# Altium project lamp_controller.PrjPcb (part 2 of 4)
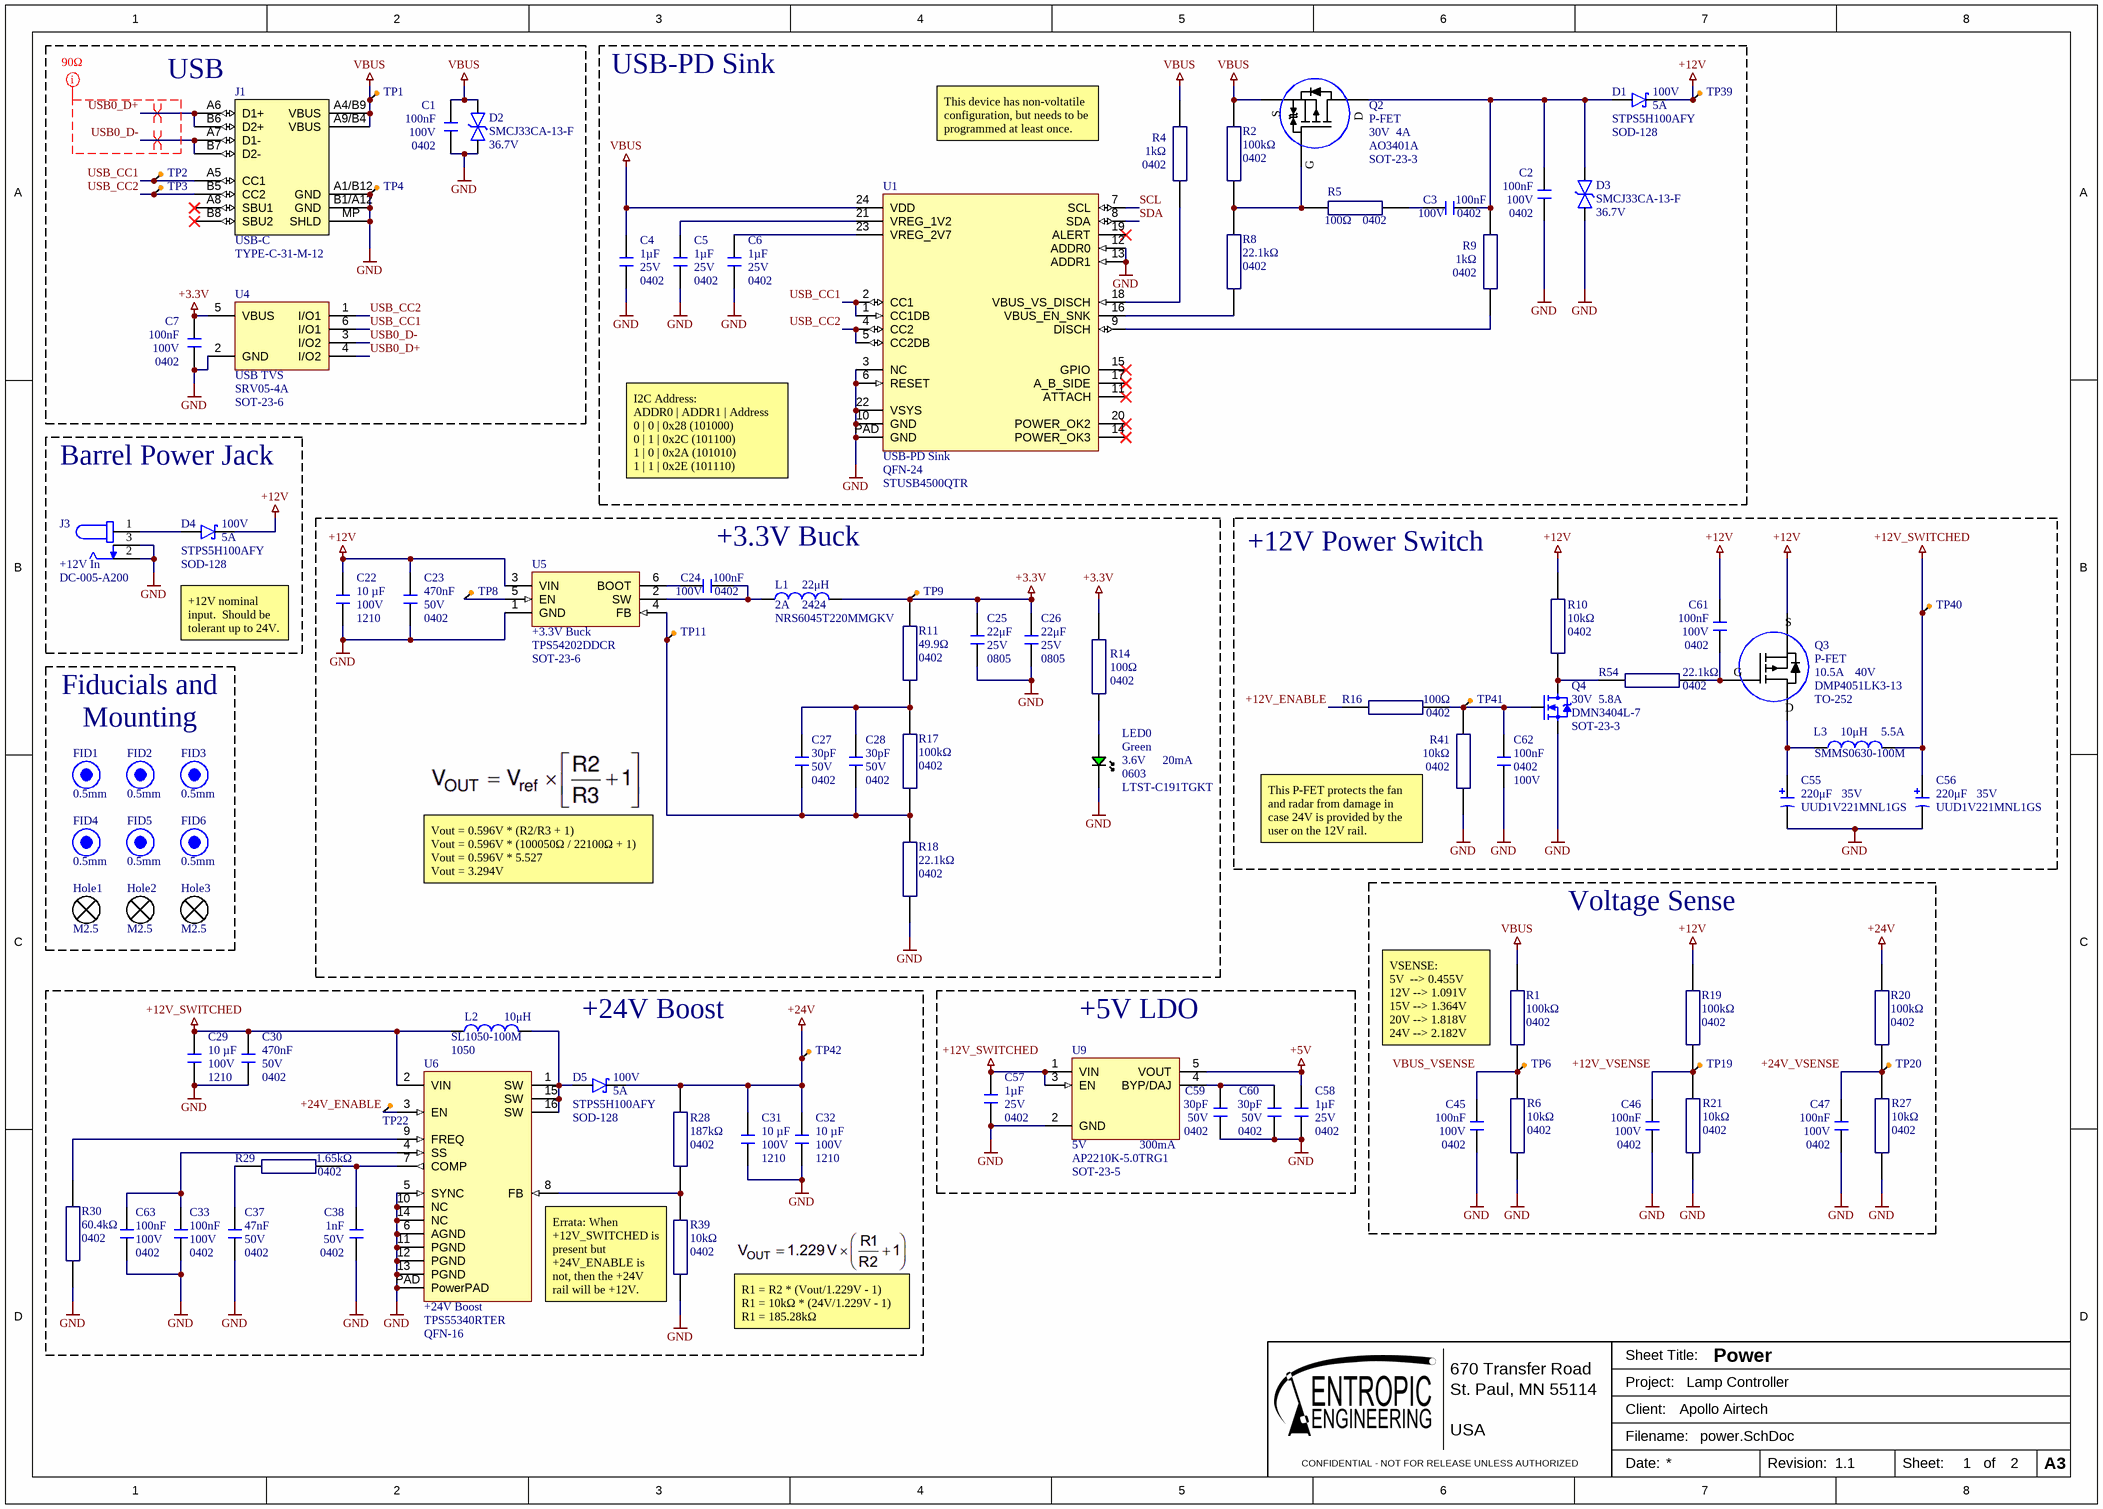
[diagram p3: power.SchDoc]

## Sheet power.SchDoc: Power (continued)
### Library data of the parts
C1-C3 C7 C24 C33 C45-C47 C61-C63 = GRM155R62A104KE14D: 100 nF, 100 V, X7R, 0402 Chip capacitor; Manufacturer: Murata; Dielectric Material: Ceramic; Multilayer: Yes; Tolerance  (fill in as +-): 10%; Temperature Characteristics Code: X5R; Supplier 1: LCSC; Supplier Part Number 1: C162178; RoHS: Yes; Category: Ceramic Capacitors; Pricing 1: 50=0.0085, 500=0.0066, 1500=0.0057, 10000=0.0051, 20000=0.0048, 50000=0.0047 (USD); Min Operating Temperature: -55°C; Max Operating Temperature: 85°C; Packaging: Tape and Reel; Termination: Wraparound; RoHS Compliant: Yes; ComponentLink1URL: https://datasheet.ciiva.com:443/pdfs/VipMasterIC/IC/MURE/MURE-S-A0004362469/MURE-S-A0004364737-1.pdf?src-supplier=IHS+Markit; ComponentLink1Description: https://datasheet.ciiva.com:443/pdfs/VipMasterIC/IC/MURE/MURE-S-A0004362469/MURE-S-A0004364737-1.pdf?src-supplier=IHS+Markit; ComponentLink2URL: http://www.farnell.com/datasheets/2079151.pdf?src-supplier=Farnell; ComponentLink2Description: http://www.farnell.com/datasheets/2079151.pdf?src-supplier=Farnell; ComponentLink3URL: http://www.mouser.com/ds/2/281/c02e-2905.pdf?src-supplier=Mouser; ComponentLink3Description: http://www.mouser.com/ds/2/281/c02e-2905.pdf?src-supplier=Mouser; ComponentLink4URL: http://www.farnell.com/datasheets/2079151.pdf?src-supplier=Element14; ComponentLink4Description: http://www.farnell.com/datasheets/2079151.pdf?src-supplier=Element14; ComponentLink5URL: http://www.farnell.com/datasheets/2079151.pdf?src-supplier=Newark; ComponentLink5Description: http://www.farnell.com/datasheets/2079151.pdf?src-supplier=Newark; ComponentLink6URL: https://datasheet.octopart.com/GRM155R62A104KE14D-Murata-datasheet-149523038.pdf?src-supplier=Newark; ComponentLink6Description: https://datasheet.octopart.com/GRM155R62A104KE14D-Murata-datasheet-149523038.pdf?src-supplier=Newark; ComponentLink7URL: https://datasheet.octopart.com/GRM155R62A104KE14D-Murata-datasheet-66077071.pdf?src-supplier=Element14; ComponentLink7Description: https://datasheet.octopart.com/GRM155R62A104KE14D-Murata-datasheet-66077071.pdf?src-supplier=Element14; ComponentLink8URL: http://search.murata.co.jp/Ceramy/image/img/A01X/G101/ENG/GRM155R62A104KE14-01.pdf?src-supplier=Digikey; ComponentLink8Description: http://search.murata.co.jp/Ceramy/image/img/A01X/G101/ENG/GRM155R62A104KE14-01.pdf?src-supplier=Digikey; ComponentLink9URL: https://datasheet.octopart.com/GRM155R62A104KE14D-Murata-datasheet-22122223.pdf?src-supplier=Future+Electronics; ComponentLink9Description: https://datasheet.octopart.com/GRM155R62A104KE14D-Murata-datasheet-22122223.pdf?src-supplier=Future+Electronics; Manufacturer Part Number: GRM155R62A104KE14D; Stock 1: 283300; Mounting Technology: Surface Mount; Pins: 2; Package Shape: Rectangular; Terminal Finish: Nickel; JESD-609 Code: e3; Capacitor Type: Ceramic; Tolerance (fill in as +-): 10%; Reach SVHC Compliant: Yes; ComponentLink10URL: https://datasheet.octopart.com/GRM155R62A104KE14D-Murata-datasheet-165579666.pdf?src-supplier=TME; ComponentLink10Description: https://datasheet.octopart.com/GRM155R62A104KE14D-Murata-datasheet-165579666.pdf?src-supplier=TME
C4-C6 C57 C58 = GRM155R61E105KA12D: 1 µF, 25 V, X5R, 0402 Chip capacitor; Manufacturer: Murata; house_part_number: C-1uF-0402-002; Dielectric Material: Ceramic; Multilayer: Yes; Negative Tolerance: 10%; Supplier 1: Digi-Key; Supplier Part Number 1: 490-10017-1-ND; RoHS: Yes; Category: Ceramic Capacitors; Stock 1: 145965; Pricing 1: 1=0.11000, 10=0.08300, 50=0.04560, 100=0.03720, 500=0.02656, 1000=0.02087, 2500=0.01898, 5000=0.01746 (USD); Mount: Surface Mount; Number of Pins: 2; Package Shape: Rectangular; Terminal Finish: Nickel; Min Operating Temperature: -55°C; Max Operating Temperature: 85°C; JESD-609 Code: e3; Capacitor Type: Ceramic; Package Style: SMTMeter; Packaging: Tape and Reel; Positive Tolerance: 10%; Temperature Characteristics Code: X5R; Termination: Wraparound; Length: 1mm; Width: 0.5mm; Height: 0.5mm; REACH SVHC: Yes; RoHS Compliant: Yes; ComponentLink1URL: https://datasheet.ciiva.com:443/pdfs/VipMasterIC/IC/MURE/MURE-S-A0004362469/MURE-S-A0004364524-1.pdf?src-supplier=IHS+Markit; ComponentLink1Description: https://datasheet.ciiva.com:443/pdfs/VipMasterIC/IC/MURE/MURE-S-A0004362469/MURE-S-A0004364524-1.pdf?src-supplier=IHS+Markit; ComponentLink2URL: https://datasheet.ciiva.com/7719/1666664-7719006.pdf?src-supplier=Element14; ComponentLink2Description: https://datasheet.ciiva.com/7719/1666664-7719006.pdf?src-supplier=Element14; ComponentLink3URL: https://datasheet.ciiva.com/22732/1666664-22732122.pdf?src-supplier=Element14; ComponentLink3Description: https://datasheet.ciiva.com/22732/1666664-22732122.pdf?src-supplier=Element14; Manufacturer Part Number: GRM155R61E105KA12D
C22 C29 C31 C32 = GRM32EC72A106KE05L: 10 µF, 100 V, 1210 Ceramic capacitor; Manufacturer: Murata; Tolerance: 10%; Supplier 1: Digi-Key; Stock 1: 4827; Pricing 1: 1=1.38, 10=1.087, 100=0.8151, 500=0.61582 (USD); Mount: Surface Mount; Case Code (Imperial): 1210; Case Code (Metric): 3225; Min Operating Temperature: -55°C; Max Operating Temperature: 125°C; Packaging: Tape and Reel; ComponentLink1URL: http://search.murata.co.jp/Ceramy/image/img/A01X/G101/ENG/GRM32EC72A106KE05-01.pdf?src-supplier=Digi-Key; ComponentLink1Description: http://search.murata.co.jp/Ceramy/image/img/A01X/G101/ENG/GRM32EC72A106KE05-01.pdf?src-supplier=Digi-Key; Supplier Part Number 1: 490-16266-1-ND; Manufacturer Part Number: GRM32EC72A106KE05L
C23 C30 = GRM155R61H474KE11D: 470 nF, 50 V, X5R, 0402 Chip capacitor; Manufacturer: Murata; house_part_number: C-470nF-0402-002; Tolerance: 10%; Supplier 1: Digi-Key; Supplier Part Number 1: 490-16354-1-ND; RoHS: Yes; Category: Ceramic Capacitors; Pricing 1: 1=0.20000, 10=0.14600, 50=0.08260, 100=0.06840, 500=0.04798, 1000=0.03972, 2500=0.03696, 5000=0.03382 (USD); Dielectric: X5R; Length: 1mm; Width: 500um; Thickness: 500um; RoHS Compliant: Yes; ComponentLink1URL: http://search.murata.co.jp/Ceramy/image/img/A01X/G101/ENG/GRM155R61H474KE11-01.pdf?src-supplier=Digi-Key; ComponentLink1Description: http://search.murata.co.jp/Ceramy/image/img/A01X/G101/ENG/GRM155R61H474KE11-01.pdf?src-supplier=Digi-Key; ComponentLink2URL: https://search.murata.co.jp/Ceramy/image/img/A01X/G101/ENG/GRM155R61H474KE11-01.pdf?src-supplier=Digi-Key; ComponentLink2Description: https://search.murata.co.jp/Ceramy/image/img/A01X/G101/ENG/GRM155R61H474KE11-01.pdf?src-supplier=Digi-Key; Manufacturer Part Number: GRM155R61H474KE11D
C25 C26 = GRT21BR61E226ME13L: 22 μF, 25 V, X5R, 0805 Chip capacitor; Manufacturer: Murata; Dielectric Material: Ceramic; Multilayer: Yes; Tolerance  (fill in as +-): 20%; Reference Standard: AEC-Q200; Supplier 1: Digi-Key; RoHS: Yes; Category: Ceramic Capacitors; Stock 1: 1983731; Pricing 1: 1=0.48, 10=0.338, 50=0.2558, 100=0.2228, 500=0.16508, 1000=0.14031 (USD); Mounting Technology: Surface Mount; Pins: 2; Package Shape: Rectangular; Terminal Finish: Nickel; Min Operating Temperature: -55°C; Max Operating Temperature: 85°C; JESD-609 Code: e3; Capacitor Type: Ceramic; Packaging: Tape and Reel; Tolerance (fill in as +-): 20%; Temperature Characteristics Code: X5R; Termination: Wraparound; Reach SVHC Compliant: Yes; RoHS Compliant: Yes; ComponentLink1URL: https://datasheet.ciiva.com:443/pdfs/VipMasterIC/IC/MURE/MURE-S-A0004410517/MURE-S-A0004413512-1.pdf?src-supplier=IHS+Markit; ComponentLink1Description: https://datasheet.ciiva.com:443/pdfs/VipMasterIC/IC/MURE/MURE-S-A0004410517/MURE-S-A0004413512-1.pdf?src-supplier=IHS+Markit; ComponentLink2URL: http://search.murata.co.jp/Ceramy/image/img/A01X/G101/ENG/GRT21BR61E226ME13-01.pdf?src-supplier=Digi-Key; ComponentLink2Description: http://search.murata.co.jp/Ceramy/image/img/A01X/G101/ENG/GRT21BR61E226ME13-01.pdf?src-supplier=Digi-Key; Manufacturer Part Number: GRT21BR61E226ME13L; Supplier Part Number 1: 490-12389-1-ND
C27 C28 C59 C60 = GCM1555C1H300FA16D: 30 pF, 50 V, C0G, 0402 Chip capacitor; Manufacturer: Murata; Dielectric Material: Ceramic; Multilayer: Yes; Tolerance  (fill in as +-): 1%; Reference Standard: AEC-Q200; Supplier 1: LCSC; Manufacturer Part Number: GCM1555C1H300FA16D; RoHS: Yes; Category: Ceramic Capacitors; Stock 1: 20680; Pricing 1: 20=0.0242, 200=0.0198, 600=0.0174, 2000=0.0159, 10000=0.0143, 20000=0.0137 (USD); Mounting Technology: Surface Mount; Pins: 2; Package Shape: Rectangular; Min Operating Temperature: -55°C; Max Operating Temperature: 125°C; Capacitor Type: Ceramic; Packaging: Tape and Reel; Tolerance (fill in as +-): 1%; Temperature Characteristics Code: C0G; Termination: Wraparound; Reach SVHC Compliant: Yes; RoHS Compliant: Yes; ComponentLink1URL: https://psearch.en.murata.com:443/capacitor/product/GCM1555C1H300FA16%23.pdf?src-supplier=IHS+Markit; ComponentLink1Description: https://psearch.en.murata.com:443/capacitor/product/GCM1555C1H300FA16%23.pdf?src-supplier=IHS+Markit; Supplier Part Number 1: C2987943
C37 = GRM155R71H473KE14D: 47 nF, 50 V, X7R, 0402 Chip capacitor; Manufacturer: Murata; house_part_number: C-47nF-0402-001; Supplier 1: Digi-Key; Supplier Part Number 1: 490-10702-1-ND; RoHS: Yes; Category: Ceramic Capacitors; Stock 1: 874627; Pricing 1: 1=0.10000, 10=0.03000, 50=0.01660, 100=0.01350, 500=0.00966, 1000=0.00759, 2500=0.00690, 5000=0.00635 (USD); ComponentLink1URL: https://datasheet.ciiva.com:443/pdfs/VipMasterIC/IC/MURE/MURE-S-A0004362469/MURE-S-A0004364796-1.pdf?src-supplier=IHS+Markit; ComponentLink1Description: https://datasheet.ciiva.com:443/pdfs/VipMasterIC/IC/MURE/MURE-S-A0004362469/MURE-S-A0004364796-1.pdf?src-supplier=IHS+Markit; ComponentLink2URL: http://www.mouser.com/ds/2/281/c02e-2905.pdf?src-supplier=Mouser; ComponentLink2Description: http://www.mouser.com/ds/2/281/c02e-2905.pdf?src-supplier=Mouser; ComponentLink3URL: http://search.murata.co.jp/Ceramy/image/img/A01X/G101/ENG/GRM155R71H473KE14-01.pdf?src-supplier=Digi-Key; ComponentLink3Description: http://search.murata.co.jp/Ceramy/image/img/A01X/G101/ENG/GRM155R71H473KE14-01.pdf?src-supplier=Digi-Key; Manufacturer Part Number: GRM155R71H473KE14D
C38 = CC0402KRX7R9BB102: 1 nF, 50 V, X7R, 0402 Chip capacitor; Manufacturer: Yageo; Dielectric Material: Ceramic; Tolerance: 10%; Insulation Resistance: 100GR; Supplier 1: Digi-Key; Manufacturer Part Number: CC0402KRX7R9BB102; Stock 1: 1726463; Pricing 1: 1=0.1, 10=0.019, 50=0.0104, 100=0.0085, 500=0.006, 1000=0.0048, 2500=0.0043, 5000=0.004 (USD); Mount: Surface Mount; Case Code (Metric): 1005; Case Code (Imperial): 0402; Min Operating Temperature: -55°C; Max Operating Temperature: 125°C; Packaging: Tape and Reel; Series: CC; Length: 0.039inch; Width: 0.02inch; Thickness: 0.022inch; RoHS Compliant: Yes; Lead Free: Lead Free; Halogen Free: Halogen Free; ComponentLink1URL: http://www.farnell.com/datasheets/1489800.pdf?src-supplier=Element14; ComponentLink1Description: http://www.farnell.com/datasheets/1489800.pdf?src-supplier=Element14; ComponentLink2URL: http://www.yageo.com/documents/recent/UPY-GPHC_X7R_6.3V-to-50V_18.pdf?src-supplier=Digi-Key; ComponentLink2Description: http://www.yageo.com/documents/recent/UPY-GPHC_X7R_6.3V-to-50V_18.pdf?src-supplier=Digi-Key; ComponentLink3URL: http://www.mouser.com/ds/2/447/Yageo_UPY-GP_NP0_16V-to-50V_9-358835.pdf?src-supplier=Mouser; ComponentLink3Description: http://www.mouser.com/ds/2/447/Yageo_UPY-GP_NP0_16V-to-50V_9-358835.pdf?src-supplier=Mouser; ComponentLink4URL: https://www.verical.com/server-webapp/html/getDatasheet?partID=403474&src-supplier=Verical; ComponentLink4Description: https://www.verical.com/server-webapp/html/getDatasheet?partID=403474&src-supplier=Verical; ComponentLink5URL: http://www.yageo.com/documents/recent/UPY-GPHC_X7R_6.3V-to-50V_8.pdf?src-supplier=Avnet+Europe; ComponentLink5Description: http://www.yageo.com/documents/recent/UPY-GPHC_X7R_6.3V-to-50V_8.pdf?src-supplier=Avnet+Europe; Supplier Part Number 1: 311-1036-1-ND
C55 C56 = UUD1V221MNL1GS: 220 μF, 35 V, 8mm Electrolytic capacitor; Manufacturer: Nichicon; Dielectric Material: Aluminium; Polarity: Polarized; Leakage Current: 77uA; Tolerance  (fill in as +-): 20%; Ripple Current: 225mA; Tan Delta: 0.14; Supplier 1: LCSC; RoHS: Yes; Category: Aluminum Electrolytic Capacitors; Stock 1: 28395; Pricing 1: 5=0.2357, 50=0.1846, 150=0.1627, 500=0.1284, 2500=0.1162, 5000=0.1089 (USD); Mounting Technology: Surface Mount; Pins: 2; Terminal Finish: Tin; Package Shape: Cylindrical; Case/Package: 3333; Min Operating Temperature: -55°C; Max Operating Temperature: 105°C; JESD-609 Code: e6; Capacitor Type: Aluminium; Package Style: SMTMeter; Packaging: Tape and Reel; Tolerance (fill in as +-): 20%; Termination: Flat; Length: 8.9mm; Width: 8.3mm; Height: 10mm; Reach SVHC Compliant: No; RoHS Compliant: Yes; ComponentLink1URL: https://datasheet.ciiva.com:443/pdfs/VipMasterIC/IC/NICH/NICH-S-A0009240538/NICH-S-A0009240538-1.pdf?src-supplier=IHS+Markit; ComponentLink1Description: https://datasheet.ciiva.com:443/pdfs/VipMasterIC/IC/NICH/NICH-S-A0009240538/NICH-S-A0009240538-1.pdf?src-supplier=IHS+Markit; ComponentLink2URL: https://datasheet.ciiva.com/11778/0900766b80fa39e7-11778272.pdf?src-supplier=Rs; ComponentLink2Description: https://datasheet.ciiva.com/11778/0900766b80fa39e7-11778272.pdf?src-supplier=Rs; ComponentLink3URL: https://datasheet.ciiva.com/97/e-ud-97948.pdf?src-supplier=Digikey; ComponentLink3Description: https://datasheet.ciiva.com/97/e-ud-97948.pdf?src-supplier=Digikey; ComponentLink4URL: https://datasheet.ciiva.com/97/e-ud-97949.pdf?src-supplier=Digikey; ComponentLink4Description: https://datasheet.ciiva.com/97/e-ud-97949.pdf?src-supplier=Digikey; ComponentLink5URL: https://datasheet.ciiva.com/97/e-ud-97950.pdf?src-supplier=Digikey; ComponentLink5Description: https://datasheet.ciiva.com/97/e-ud-97950.pdf?src-supplier=Digikey; ComponentLink6URL: https://datasheet.ciiva.com/15199/getdatasheetpartid-317116-15199222.pdf?src-supplier=Verical; ComponentLink6Description: https://datasheet.ciiva.com/15199/getdatasheetpartid-317116-15199222.pdf?src-supplier=Verical; Supplier Part Number 1: C251000; Manufacturer Part Number: UUD1V221MNL1GS
D1 D4 D5 = STPS5H100AFY: Schottky diode, 100V, 5A, SOD-128; Manufacturer: STMicroelectronics; Forward Voltage: 760mV; Diode Element Material: SILICON; Package Body Material: Plastic; Application(s): HIGH VOLTAGE POWER; Diode Type: RECTIFIER; Non-rep Pk Forward Current-Max: 130A; Number of Elements: 1; Max Reverse Current: 3.5uA; Reference Standard: AEC-Q101; Supplier 1: Digikey; Stock 1: 55724; Pricing 1: 1=0.78, 10=0.526, 100=0.4102, 500=0.31624, 1000=0.28596 (USD); ComponentLink1URL: https://datasheet.ciiva.com:443/pdfs/VipMasterIC/IC/SGST/SGST-S-A0002952656/SGST-S-A0002952656-1.pdf?src-supplier=IHS+Markit; ComponentLink1Description: https://datasheet.ciiva.com:443/pdfs/VipMasterIC/IC/SGST/SGST-S-A0002952656/SGST-S-A0002952656-1.pdf?src-supplier=IHS+Markit; ComponentLink2URL: http://www.farnell.com/datasheets/2816111.pdf?src-supplier=Farnell; ComponentLink2Description: http://www.farnell.com/datasheets/2816111.pdf?src-supplier=Farnell; ComponentLink3URL: http://www.st.com/content/ccc/resource/technical/document/datasheet/group3/a7/aa/f5/d0/a8/25/41/d5/DM00303942/files/DM00303942.pdf/jcr:content/translations/en.DM00303942.pdf?src-supplier=Digikey; ComponentLink3Description: http://www.st.com/content/ccc/resource/technical/document/datasheet/group3/a7/aa/f5/d0/a8/25/41/d5/DM00303942/files/DM00303942.pdf/jcr:content/translations/en.DM00303942.pdf?src-supplier=Digikey; Supplier Part Number 1: 497-17312-1-ND; Manufacturer Part Number: STPS5H100AFY; RoHS: Yes; Category: Rectifier Diodes; Pins: 2; Package Shape: Rectangular; Min Operating Temperature: -40°C; Max Operating Temperature: 175°C; JESD-30 Code: R-PDSO-F2; Number of Phases: 1; Package Style: SMALL OUTLINEMeter; Surface Mount: Yes; Technology: SCHOTTKY; Terminal Form: Flat; Terminal Position: DUAL; RoHS Compliant: Yes; Reach SVHC Compliant: No; ComponentLink4URL: http://www.farnell.com/datasheets/2816111.pdf?src-supplier=Newark; ComponentLink4Description: http://www.farnell.com/datasheets/2816111.pdf?src-supplier=Newark; ComponentLink5URL: https://datasheet.octopart.com/STPS5H100AFY-STMicroelectronics-datasheet-97040641.pdf?src-supplier=Future+Electronics; ComponentLink5Description: https://datasheet.octopart.com/STPS5H100AFY-STMicroelectronics-datasheet-97040641.pdf?src-supplier=Future+Electronics
D2 D3 = SMCJ33CA-13-F: TVS diode, Trans Voltage Suppressor Diode, 1500W, 33V V(RWM), Bidirectional, 1 Element, Silicon; Manufacturer: Diodes; Package Body Material: Plastic; Additional Feature: EXCELLENT CLAMPING CAPABILITY; Max Breakdown Voltage: 40.6V; Breakdown Voltage-Nom: 38.7V; Clamping Voltage-Max: 53.3V; Non-rep Peak Rev Power Dis-Max: 1.5kW; Number of Elements: 1; Max Power Dissipation: 5W; Time @ Peak Reflow Temperature-Max (s): 40s; Qualification Status: Not Qualified; Supplier 1: LCSC; Manufacturer Part Number: SMCJ33CA-13-F; RoHS: Yes; Category: TVS Diodes; Stock 1: 2995; Pricing 1: 5=0.2921, 50=0.2375, 150=0.2141, 500=0.185, 3000=0.172, 6000=0.1642 (USD); Pins: 2; Diode Element Material: SILICON; Package Shape: Rectangular; Terminal Finish: Tin; Min Operating Temperature: -55°C; Max Operating Temperature: 150°C; JESD-609 Code: e3; Polarity: Bidirectional; Diode Type: TRANS VOLTAGE SUPPRESSOR; JESD-30 Code: R-PDSO-C2; Moisture Sensitivity Level: 1; Package Style: SMALL OUTLINEMeter; Peak Reflow Temperature (Cel): 260°C; Rep Pk Reverse Voltage-Max: 33V; Surface Mount: Yes; Technology: AVALANCHE; Terminal Form: C BEND; Terminal Position: DUAL; RoHS Compliant: Yes; Reach SVHC Compliant: No; ComponentLink1URL: https://datasheet.ciiva.com:443/pdfs/VipMasterIC/IC/DIOD/DIOD-S-A0000285740/DIOD-S-A0000285740-1.pdf?src-supplier=IHS+Markit; ComponentLink1Description: https://datasheet.ciiva.com:443/pdfs/VipMasterIC/IC/DIOD/DIOD-S-A0000285740/DIOD-S-A0000285740-1.pdf?src-supplier=IHS+Markit; ComponentLink2URL: http://www.mouser.com/ds/2/115/ds19003-73575.pdf?src-supplier=Mouser; ComponentLink2Description: http://www.mouser.com/ds/2/115/ds19003-73575.pdf?src-supplier=Mouser; ComponentLink3URL: http://components.arrow.com/part/dataview/41510117S9851208N2867?src-supplier=Arrow+Electronics; ComponentLink3Description: http://components.arrow.com/part/dataview/41510117S9851208N2867?src-supplier=Arrow+Electronics; ComponentLink4URL: https://datasheet.octopart.com/SMCJ33CA-13-F-Diodes-Inc.-datasheet-6912.pdf?src-supplier=Digikey; ComponentLink4Description: https://datasheet.octopart.com/SMCJ33CA-13-F-Diodes-Inc.-datasheet-6912.pdf?src-supplier=Digikey; ComponentLink5URL: http://www.diodes.com//datasheets/ds19003.pdf?src-supplier=Avnet; ComponentLink5Description: http://www.diodes.com//datasheets/ds19003.pdf?src-supplier=Avnet; ComponentLink6URL: http://www.diodes.com///datasheets/ds19003.pdf?src-supplier=Avnet; ComponentLink6Description: http://www.diodes.com///datasheets/ds19003.pdf?src-supplier=Avnet; ComponentLink7URL: http://www.diodes.com/_files/datasheets/ds19003.pdf?src-supplier=Future+Electronics; ComponentLink7Description: http://www.diodes.com/_files/datasheets/ds19003.pdf?src-supplier=Future+Electronics; ComponentLink8URL: https://datasheet.octopart.com/SMCJ33CA-13-F-Diodes-Inc.-datasheet-130126529.pdf?src-supplier=TME; ComponentLink8Description: https://datasheet.octopart.com/SMCJ33CA-13-F-Diodes-Inc.-datasheet-130126529.pdf?src-supplier=TME; Supplier Part Number 1: C135163; Package: SMC
FID1-FID6 = fiducial-0.5: 0.5mm round fiducial
Hole1-Hole3 = m2.5_hole_no_pad: M2.5 clearance hole; pickable: no
J1 = USB4105-GF-A: USB-C 2.0 Female Connector; Manufacturer: Global Connector Technology; Alternate Manufacturer: Korean HROparts Elec; Connector Type: USB; Gender: Receptacle; Mating Cycles: 10000; Shielding: Shielded; Number of Ports: 1; RoHS: No; Category: USB Connectors; Stock: 1499; Pricing: 1=1, 20=3.07, 60=3.02, 160=2.64, 400=2.63 (EUR); Mounting Technology: Surface Mount,Through Hole,Horizontal; Contact Plating: Gold; Insulation Color: Black; Min Operating Temperature: -40°C; Max Operating Temperature: 85°C; Series: USB4105; Termination: Solder; Flammability Rating: UL94 V-0; ComponentLink1URL: https://gct.co/files/drawings/usb4105.pdf?src-supplier=Digi-Key; ComponentLink1Description: https://gct.co/files/drawings/usb4105.pdf?src-supplier=Digi-Key; Alternate Part Number: USB4105-GF-A; house_part_number: USB_C_2.0_M12; Supplier 1: Farnell; Supplier Part Number 1: 3588205
J3 = DC-005-A200: 5.5 mm x 2 mm, 30V, 3A Barrel jack; Manufacturer: Xunpu; Supplier 1: LCSC; Stock 1: 33970; Pricing 1: 5=0.1077, 50=0.0871, 150=0.0764, 500=0.0636, 2500=0.0606, 5000=0.0585 (USD); Supplier Part Number 1: C720557; Manufacturer Part Number: DC-005-A200; RoHS: No
L1 = NRS6045T220MMGKV: 22 μH, 2 A, 20%, 2424 Inductor; Manufacturer: Taiyo Yuden; DC Resistance (DCR): 139.1mΩ; Inductor Application: RF INDUCTOR; Inductor Type: GENERAL PURPOSE INDUCTOR; Channels: 1; Self Resonant Frequency: 7MHz; Shape/Size Description: RECTANGULAR PACKAGE; Shielding: Unshielded; Test Frequency: 100kHz; Reference Standard: AEC-Q200; Supplier 1: LCSC; RoHS: Yes; Category: Fixed Inductors; Stock 1: 877; Pricing 1: 1=0.2713, 10=0.2238, 30=0.2035, 100=0.1781, 500=0.1668, 1500=0.16 (USD); Pins: 2; Min Operating Temperature: -40°C; Max Operating Temperature: 125°C; Tolerance: 20%; Surface Mount: Yes; Terminal Placement: Dual Ended; Termination: One Surface; Reach SVHC Compliant: Yes; RoHS Compliant: Yes; ComponentLink1URL: https://datasheet.ciiva.com:443/pdfs/VipMasterIC/IC/TAIY/TAIY-S-A0009101225/TAIY-S-A0009101504-1.pdf?src-supplier=IHS+Markit; ComponentLink1Description: https://datasheet.ciiva.com:443/pdfs/VipMasterIC/IC/TAIY/TAIY-S-A0009101225/TAIY-S-A0009101504-1.pdf?src-supplier=IHS+Markit; ComponentLink2URL: https://datasheet.ciiva.com/29697/nrs6045t220mmgkv-ss-29697444.pdf?src-supplier=Digi-Key; ComponentLink2Description: https://datasheet.ciiva.com/29697/nrs6045t220mmgkv-ss-29697444.pdf?src-supplier=Digi-Key; Supplier Part Number 1: C515390; Manufacturer Part Number: NRS6045T220MMGKV
L2 = SL1050-100M: 10 μH, 8A, 1050 Inductor; Manufacturer: TECHFUSE; RoHS: Yes; Current: 8A; Manufacturer Part Number: SL1050-100M
L3 = SMMS0630-100M: 10 μH, 5.5 A, 6.6mm x 7.3mm inductor; Manufacturer: SXN; Supplier 1: LCSC; RoHS: No; Stock 1: 72935; Pricing 1: 5=0.0834, 50=0.0677, 150=0.0596, 1000=0.0466, 2000=0.0442, 5000=0.0427 (USD); Supplier Part Number 1: C128692; Manufacturer Part Number: SMMS0630-100M
LED0 = LTST-C191TGKT: Green LED, 0603; Manufacturer: Vishay Lite-On; Shape: Rectangular; Lens Style: WATER CLEAR; Luminous Intensity-Min: 130cd; Luminous Intensity-Nom: 260.5mcd; Number of Functions: 1; Optoelectronic Device Type: SINGLE COLOR LED; Reverse Voltage-Max: 5V; Viewing Angle: 130°; Overall Height: 0.55mm; Supplier 1: Digi-Key; RoHS: Yes; Category: LEDs; Stock 1: 478546; Pricing 1: 1=0.53000, 10=0.32300, 100=0.18580, 1000=0.14544, 2000=0.13332 (USD); Mount: Surface Mount; Number of Pins: 2; Color@wavelength: Green; Terminal Finish: Tin; Min Operating Temperature: -20°C; Max Operating Temperature: 80°C; JESD-609 Code: e3; Packaging: Tape and Reel; Size: 1.1mm; Terminal Pitch: 1.5mm; Reach SVHC Compliant: Yes; RoHS Compliant: Yes; ComponentLink1URL: https://datasheet.ciiva.com:443/pdfs/VipMasterIC/IC/LITE/LITE-S-A0003155974/LITE-S-A0003155974-1.pdf?src-supplier=IHS+Markit; ComponentLink1Description: https://datasheet.ciiva.com:443/pdfs/VipMasterIC/IC/LITE/LITE-S-A0003155974/LITE-S-A0003155974-1.pdf?src-supplier=IHS+Markit; ComponentLink2URL: https://datasheet.ciiva.com/16444/ltst-c191tgkt-16444757.pdf?src-supplier=Future+Electronics; ComponentLink2Description: https://datasheet.ciiva.com/16444/ltst-c191tgkt-16444757.pdf?src-supplier=Future+Electronics; ComponentLink3URL: https://datasheet.ciiva.com/11773/0900766b80dc02b5-11773683.pdf?src-supplier=RSComponents; ComponentLink3Description: https://datasheet.ciiva.com/11773/0900766b80dc02b5-11773683.pdf?src-supplier=RSComponents; ComponentLink4URL: https://datasheet.ciiva.com/12403/lite-on-ltst-c191tgkt-190137-12403796.pdf?src-supplier=Mouser; ComponentLink4Description: https://datasheet.ciiva.com/12403/lite-on-ltst-c191tgkt-190137-12403796.pdf?src-supplier=Mouser; ComponentLink5URL: https://datasheet.ciiva.com/6352/s-110-ltst-c191tgkt-6352682.pdf?src-supplier=Digi-Key; ComponentLink5Description: https://datasheet.ciiva.com/6352/s-110-ltst-c191tgkt-6352682.pdf?src-supplier=Digi-Key; ComponentLink6URL: https://datasheet.ciiva.com/6352/s-110-ltst-c191tgkt-6352684.pdf?src-supplier=Digi-Key; ComponentLink6Description: https://datasheet.ciiva.com/6352/s-110-ltst-c191tgkt-6352684.pdf?src-supplier=Digi-Key; ComponentLink7URL: https://datasheet.ciiva.com/6352/s-110-ltst-c191tgkt-6352683.pdf?src-supplier=Digi-Key; ComponentLink7Description: https://datasheet.ciiva.com/6352/s-110-ltst-c191tgkt-6352683.pdf?src-supplier=Digi-Key; Supplier Part Number 1: 160-1888-1-ND; House Part Number: LTST-C191TGKT; Manufacturer Part Number: LTST-C191TGKT
Q2 = AO3401A: P-FET, 30V, 4A, SOT-23-3; Manufacturer: Alpha & Omega Semiconductor; Transistor Element Material: SILICON; Number of Elements: 1; Polarity/Channel Type: P-CHANNEL; Drain-source On Resistance-Max: 50mR; FET Technology: METAL-OXIDE SEMICONDUCTOR; Operating Mode: ENHANCEMENT MODE; Power Dissipation-Max (Abs): 1.4W; Transistor Application: SWITCHING; Package Body Material: Plastic; RoHS: Yes; Category: MOSFETs; Pins: 3; Max Operating Temperature: 150°C; RoHS Compliant: Yes; ComponentLink1URL: https://datasheet.ciiva.com:443/pdfs/VipMasterIC/IC/ALOM/ALOMS00379/ALOMS00379-1.pdf?src-supplier=IHS+Markit; ComponentLink1Description: https://datasheet.ciiva.com:443/pdfs/VipMasterIC/IC/ALOM/ALOMS00379/ALOMS00379-1.pdf?src-supplier=IHS+Markit; ComponentLink2URL: https://datasheet.ciiva.com/940/ao3401a-940720.pdf?src-supplier=Digikey; ComponentLink2Description: https://datasheet.ciiva.com/940/ao3401a-940720.pdf?src-supplier=Digikey; Manufacturer Part Number: AO3401A; Supplier 1: LCSC; Supplier Part Number 1: C15127; Stock 1: 274360; Pricing 1: 10=0.0527, 100=0.0437, 300=0.039, 3000=0.0352, 6000=0.0338, 9000=0.0329 (USD); Package Shape: Rectangular; JESD-30 Code: R-PDSO-G3; Package Style: SMALL OUTLINEMeter; Surface Mount: Yes; Terminal Form: Gull Wing; Terminal Position: DUAL; Drain Current-Max (Abs) (ID): 4A; Reach SVHC Compliant: Yes; ComponentLink3URL: https://datasheet.ciiva.com/26927/getdatasheetpartid-79048-26927888.pdf?src-supplier=Verical; ComponentLink3Description: https://datasheet.ciiva.com/26927/getdatasheetpartid-79048-26927888.pdf?src-supplier=Verical
Q3 = DMP4051LK3-13: P-FET, 40V, 10.5A, TO-252; Manufacturer: Diodes Zetex; Drain-source On Resistance-Max: 51mR; Input Capacitance: 674pF; Max Power Dissipation: 4.18W; Rise Time: 14.1ns; Number of Channels: 1; Drain to Source Resistance: 41mR; Fall Time: 14.3ns; Turn-Off Delay Time: 25.1ns; Turn-On Delay Time: 2.3ns; Threshold Voltage: -3V; Gate to Source Voltage (Vgs): 20V; Value: 51mR; RoHS: Yes; Category: MOSFETs; Pins: 3; Max Operating Temperature: 150°C; RoHS Compliant: Yes; ComponentLink1URL: https://datasheet.ciiva.com/935/dmp4051lk3-935120.pdf?src-supplier=Digikey; ComponentLink1Description: https://datasheet.ciiva.com/935/dmp4051lk3-935120.pdf?src-supplier=Digikey; ComponentLink2URL: https://datasheet.ciiva.com/4443/dmp4051lk3-70059-4443156.pdf?src-supplier=Mouser; ComponentLink2Description: https://datasheet.ciiva.com/4443/dmp4051lk3-70059-4443156.pdf?src-supplier=Mouser; Manufacturer Part Number: DMP4051LK3-13; Supplier 1: LCSC; Supplier Part Number 1: C397952; Stock 1: 7860; Pricing 1: 5=0.2313, 50=0.1826, 150=0.1618, 500=0.1358, 2500=0.1193, 5000=0.1123 (USD); Reach SVHC Compliant: No; ComponentLink3URL: https://datasheet.ciiva.com/935/dmp4051lk3-935119.pdf?src-supplier=Digikey; ComponentLink3Description: https://datasheet.ciiva.com/935/dmp4051lk3-935119.pdf?src-supplier=Digikey; Mounting Technology: Surface Mount; Weight: 0.139332oz; Min Operating Temperature: -55°C; Package Quantity: 1; Packaging: Tape and Reel; Rds On Max: 51mR; Series: -; Length: 6.7mm; Width: 6.2mm; Height: 2.39mm; Lead Free: Lead Free; ComponentLink4URL: https://datasheet.ciiva.com/935/dmp4051lk3-935121.pdf?src-supplier=Digikey; ComponentLink4Description: https://datasheet.ciiva.com/935/dmp4051lk3-935121.pdf?src-supplier=Digikey; ComponentLink5URL: https://datasheet.ciiva.com/16434/dmp4051lk3-16434015.pdf?src-supplier=Future+Electronics; ComponentLink5Description: https://datasheet.ciiva.com/16434/dmp4051lk3-16434015.pdf?src-supplier=Future+Electronics; Polarity: P-FET; Case/Package: TO-252
Q4 = DMN3404L-7: N-FET, 30 V, 5.8 A, SOT-23-3; Manufacturer: Diodes; Package Body Material: Plastic; Transistor Element Material: SILICON; Polarity/Channel Type: N-CHANNEL; Additional Feature: HIGH RELIABILITY; Drain-source On Resistance-Max: 28mR; FET Technology: METAL-OXIDE SEMICONDUCTOR; Number of Elements: 1; Operating Mode: ENHANCEMENT MODE; Power Dissipation-Max (Abs): 1.4W; Pulsed Drain Current-Max (IDM): 30A; Time @ Peak Reflow Temperature-Max (s): 40s; Transistor Application: SWITCHING; Qualification Status: Not Qualified; Supplier 1: Digi-Key; RoHS: Yes; Category: MOSFETs; Stock 1: 150000; Pricing 1: 3000=0.07535, 6000=0.06781, 15000=0.06028, 30000=0.05651, 75000=0.05011, 150000=0.04822 (USD); Pins: 3; Package Shape: Rectangular; Terminal Finish: Tin; Max Operating Temperature: 150°C; JESD-609 Code: e3; Drain Current-Max (Abs) (ID): 5.8A; JESD-30 Code: R-PDSO-G3; Moisture Sensitivity Level: 1; Package Style: SMALL OUTLINEMeter; Peak Reflow Temperature (Cel): 260°C; Surface Mount: Yes; Terminal Form: Gull Wing; Terminal Position: DUAL; Reach SVHC Compliant: Yes; RoHS Compliant: Yes; ComponentLink1URL: https://datasheet.ciiva.com:443/pdfs/VipMasterIC/IC/DIOD/DIODS20277/DIODS20277-1.pdf?src-supplier=IHS+Markit; ComponentLink1Description: https://datasheet.ciiva.com:443/pdfs/VipMasterIC/IC/DIOD/DIODS20277/DIODS20277-1.pdf?src-supplier=IHS+Markit; ComponentLink2URL: https://datasheet.ciiva.com/4444/ds31787-65102-4444489.pdf?src-supplier=Mouser; ComponentLink2Description: https://datasheet.ciiva.com/4444/ds31787-65102-4444489.pdf?src-supplier=Mouser; ComponentLink3URL: https://datasheet.ciiva.com/8115/ds31787-8115384.pdf?src-supplier=Avnet; ComponentLink3Description: https://datasheet.ciiva.com/8115/ds31787-8115384.pdf?src-supplier=Avnet; ComponentLink4URL: https://datasheet.ciiva.com/16508/ds31787-16508477.pdf?src-supplier=Future+Electronics; ComponentLink4Description: https://datasheet.ciiva.com/16508/ds31787-16508477.pdf?src-supplier=Future+Electronics; ComponentLink5URL: https://datasheet.ciiva.com/8023/ds31787-8023981.pdf?src-supplier=Element14; ComponentLink5Description: https://datasheet.ciiva.com/8023/ds31787-8023981.pdf?src-supplier=Element14; ComponentLink6URL: https://datasheet.ciiva.com/934/ds31787-934594.pdf?src-supplier=Digi-Key; ComponentLink6Description: https://datasheet.ciiva.com/934/ds31787-934594.pdf?src-supplier=Digi-Key; ComponentLink7URL: https://datasheet.ciiva.com/934/ds31787-934595.pdf?src-supplier=Digi-Key; ComponentLink7Description: https://datasheet.ciiva.com/934/ds31787-934595.pdf?src-supplier=Digi-Key; ComponentLink8URL: https://datasheet.ciiva.com/934/ds31787-934593.pdf?src-supplier=Digi-Key; ComponentLink8Description: https://datasheet.ciiva.com/934/ds31787-934593.pdf?src-supplier=Digi-Key; Supplier Part Number 1: DMN3404LDITR-ND; Package: SOT-23-3; Manufacturer Part Number: DMN3404L-7
R1 R2 R17 R19 R20 = RMCF0402FT100K: 100 kΩ, 0402 Chip resistor; Manufacturer: Stackpole Electronics; Tolerance: 1%; Power: 63mW; Rated Temperature: 70°C; Temperature Coefficient: 100ppm/°C; Working Voltage: 50V; Package Height: 0.3mm; Package Length: 1mm; Package Width: 0.5mm; Reference Standard: AEC-Q200; Supplier 1: Digi-Key; Manufacturer Part Number: RMCF0402FT100K; RoHS: Yes; Category: Chip SMD Resistors; Stock 1: 3573736; Pricing 1: 1=0.1, 10=0.02, 50=0.011, 100=0.0089, 500=0.00566, 1000=0.00475, 5000=0.00328 (USD); Mounting Technology: Surface Mount; Pins: 2; Package Shape: Rectangular; Terminal Finish: Nickel; Min Operating Temperature: -55°C; Max Operating Temperature: 155°C; JESD-609 Code: e3; Resistor Type: FIXED RESISTOR; Construction: Rectangular; Package Style: SMTMeter; Packaging: Tape and Reel; Technology: METAL GLAZE/THICK FILM; Termination: Wraparound; Reach SVHC Compliant: Yes; RoHS Compliant: Yes; ComponentLink1URL: https://datasheet.ciiva.com:443/pdfs/VipMasterIC/IC/SEIE/SEIE-S-A0009541969/SEIE-S-A0009541969-1.pdf?src-supplier=IHS+Markit; ComponentLink1Description: https://datasheet.ciiva.com:443/pdfs/VipMasterIC/IC/SEIE/SEIE-S-A0009541969/SEIE-S-A0009541969-1.pdf?src-supplier=IHS+Markit; ComponentLink2URL: https://datasheet.ciiva.com/15193/getdatasheetpartid-482656-15193415.pdf?src-supplier=Verical; ComponentLink2Description: https://datasheet.ciiva.com/15193/getdatasheetpartid-482656-15193415.pdf?src-supplier=Verical; Supplier Part Number 1: RMCF0402FT100KCT-ND
R4 R9 = CR0402-FX-1001GLF: 1 kΩ, 0402 Chip resistor; Manufacturer: Bourns; Tolerance: 1%; Rated Power Dissipation (P): 62.5mW; Rated Temperature: 70°C; Temperature Coefficient: 100ppm/°C; Working Voltage: 50V; Package Height: 0.35mm; Package Length: 1mm; Package Width: 0.5mm; Supplier 1: Digi-Key; Manufacturer Part Number: CR0402-FX-1001GLF; RoHS: Yes; Category: Chip SMD Resistors; Stock 1: 398310; Pricing 1: 10000=0.00114 (USD); Mount: Surface Mount; Number of Pins: 2; Package Shape: Rectangular; Terminal Finish: Nickel; Min Operating Temperature: -55°C; Max Operating Temperature: 125°C; JESD-609 Code: e3; Resistor Type: FIXED RESISTOR; Construction: Chip; Package Style: SMTMeter; Packaging: Tape and Reel; Technology: RUTHENIUM OXIDE; Termination: Wraparound; REACH SVHC: Yes; RoHS Compliant: Yes; ComponentLink1URL: https://datasheet.ciiva.com:443/pdfs/VipMasterIC/IC/BOUR/BOUR-S-A0008953887/BOUR-S-A0008953887-1.pdf?src-supplier=IHS+Markit; ComponentLink1Description: https://datasheet.ciiva.com:443/pdfs/VipMasterIC/IC/BOUR/BOUR-S-A0008953887/BOUR-S-A0008953887-1.pdf?src-supplier=IHS+Markit; ComponentLink2URL: https://datasheet.ciiva.com/5734/1845296-5734926.pdf?src-supplier=Farnell; ComponentLink2Description: https://datasheet.ciiva.com/5734/1845296-5734926.pdf?src-supplier=Farnell; ComponentLink3URL: https://datasheet.ciiva.com/11821/0900766b80fcdb41-11821108.pdf?src-supplier=RSComponents; ComponentLink3Description: https://datasheet.ciiva.com/11821/0900766b80fcdb41-11821108.pdf?src-supplier=RSComponents; ComponentLink4URL: https://datasheet.ciiva.com/9123/cr0402-9123631.pdf?src-supplier=Avnet; ComponentLink4Description: https://datasheet.ciiva.com/9123/cr0402-9123631.pdf?src-supplier=Avnet; ComponentLink5URL: https://datasheet.ciiva.com/30154/cr0402-30154590.pdf?src-supplier=Onlinecomponents.com; ComponentLink5Description: https://datasheet.ciiva.com/30154/cr0402-30154590.pdf?src-supplier=Onlinecomponents.com; Supplier Part Number 1: CR0402-FX-1001GLFTR-ND
R5 R14 R16 = RMCF0402FT100R: 100 Ω, 0402 Chip resistor; Manufacturer: Stackpole Electronics; house_part_number: R-100-0402-1%-001; Power Rating: 62.5mW; Tolerance: 1%; Max Power Dissipation: 63mW; Temperature Coefficient: 100ppm/°C; Supplier 1: Digi-Key; Supplier Part Number 1: RMCF0402FT100RCT-ND; RoHS: Yes; Category: Chip SMD Resistors; Stock 1: 188482; Pricing 1: 1=0.10000, 10=0.01300, 100=0.00530, 1000=0.00238, 2500=0.00207, 5000=0.00171 (USD); Mount: Surface Mount; Case/Package: 0402; Case Code (Metric): 1005; Contact Plating: Tin,Matte; Min Operating Temperature: -55°C; Max Operating Temperature: 155°C; Packaging: Tape and Reel; Resistor Type: Thick Film; Number of Terminations: 2; Features: Automotive AEC-Q200; Series: RMCF; Construction: Rectangular; Length: 1mm; Width: 0.02inch; Height: 0.016inch; Depth: 0.5mm; Military Standard: Not; Lead Free: Lead Free; RoHS Compliant: Yes; ComponentLink1URL: http://components.arrow.com/part/dataview/50497758S7215546N1174?src-supplier=Arrow+Electronics; ComponentLink1Description: http://components.arrow.com/part/dataview/50497758S7215546N1174?src-supplier=Arrow+Electronics; ComponentLink2URL: https://www.seielect.com/catalog/sei-rmcf_rmcp.pdf?src-supplier=Digi-Key; ComponentLink2Description: https://www.seielect.com/catalog/sei-rmcf_rmcp.pdf?src-supplier=Digi-Key; ComponentLink3URL: https://www.seielect.com/Catalog/SEI-RMCF_RMCP.pdf?src-supplier=Avnet; ComponentLink3Description: https://www.seielect.com/Catalog/SEI-RMCF_RMCP.pdf?src-supplier=Avnet; ComponentLink4URL: https://www.verical.com/server-webapp/html/getDatasheet?partID=368652&src-supplier=Verical; ComponentLink4Description: https://www.verical.com/server-webapp/html/getDatasheet?partID=368652&src-supplier=Verical; ComponentLink5URL: https://www.seielect.com/Catalog/SEI-RMCF_RMCP.pdf?src-supplier=Avnet+Asia; ComponentLink5Description: https://www.seielect.com/Catalog/SEI-RMCF_RMCP.pdf?src-supplier=Avnet+Asia; Manufacturer Part Number: RMCF0402FT100R
R6 R10 R21 R27 R39 R41 = RMCF0402FT10K0: 10 kΩ, 0402 Chip resistor; Manufacturer: Stackpole Electronics; house_part_number: R-10k-0402-1%-001; Tolerance: 1%; Power Rating: 62.5mW; Temperature Coefficient: 100ppm/°C; Max Power Dissipation: 63mW; Supplier 1: Digi-Key; Manufacturer Part Number: RMCF0402FT10K0; RoHS: Yes; Category: Chip SMD Resistors; Stock 1: 7219214; Pricing 1: 1=0.10000, 10=0.01300, 100=0.00530, 1000=0.00239, 2500=0.00207, 5000=0.00171 (USD); Mount: Surface Mount; Case/Package: 0402; Case Code (Metric): 1005; Contact Plating: Tin,Matte; Size Code: 0402; Min Operating Temperature: -55°C; Max Operating Temperature: 155°C; Packaging: Tape and Reel; Resistor Type: Thick Film; Number of Terminations: 2; Features: Automotive AEC-Q200; Series: RMCF; Construction: Rectangular; Length: 1mm; Width: 0.02inch; Height: 0.016inch; Depth: 0.5mm; Radiation Hardening: No; Military Standard: Not; Lead Free: Lead Free; RoHS Compliant: Yes; ComponentLink1URL: https://datasheet.ciiva.com/24341/sei-rmcp-24341800.pdf?src-supplier=Onlinecomponents.com; ComponentLink1Description: https://datasheet.ciiva.com/24341/sei-rmcp-24341800.pdf?src-supplier=Onlinecomponents.com; Supplier Part Number 1: RMCF0402FT10K0CT-ND
R8 R18 = RC0402FR-0722K1L: 22.1 kΩ, 1%, 0402 Resistor; Manufacturer: Yageo; Power: 62.5mW; Rated Temperature: 70°C; Working Voltage: 50V; Package Height: 0.35mm; Package Length: 1mm; Package Width: 0.5mm; Additional Feature: LASER TRIMMABLE; Temperature Coefficient (ppm/Cel): 100; Supplier 1: Digikey; Manufacturer Part Number: RC0402FR-0722K1L; RoHS: Yes; Category: Chip SMD Resistors; Stock 1: 259657; Pricing 1: 1=0.1, 10=0.008, 100=0.0061, 1000=0.0051, 10000=0.00123 (USD); Mounting Technology: Surface Mount; Pins: 2; Package Shape: Rectangular; Terminal Finish: Nickel; Min Operating Temperature: -55°C; Max Operating Temperature: 155°C; Tolerance: 1%; JESD-609 Code: e3; Resistor Type: FIXED RESISTOR; Construction: Chip; Packaging: Tape and Reel; Technology: METAL GLAZE/THICK FILM; Termination: Wraparound; Reach SVHC Compliant: Yes; RoHS Compliant: Yes; ComponentLink1URL: https://datasheet.ciiva.com:443/pdfs/VipMasterIC/IC/YAGO/YAGO-S-A0008145938/YAGO-S-A0008145938-1.pdf?src-supplier=IHS+Markit; ComponentLink1Description: https://datasheet.ciiva.com:443/pdfs/VipMasterIC/IC/YAGO/YAGO-S-A0008145938/YAGO-S-A0008145938-1.pdf?src-supplier=IHS+Markit; ComponentLink2URL: https://datasheet.ciiva.com/2553/pyu-r-int-thick-7-2553200.pdf?src-supplier=Digikey; ComponentLink2Description: https://datasheet.ciiva.com/2553/pyu-r-int-thick-7-2553200.pdf?src-supplier=Digikey; ComponentLink3URL: https://datasheet.ciiva.com/2553/pyu-r-int-thick-7-2553201.pdf?src-supplier=Digikey; ComponentLink3Description: https://datasheet.ciiva.com/2553/pyu-r-int-thick-7-2553201.pdf?src-supplier=Digikey; ComponentLink4URL: https://datasheet.ciiva.com/2553/pyu-r-int-thick-7-2553202.pdf?src-supplier=Digikey; ComponentLink4Description: https://datasheet.ciiva.com/2553/pyu-r-int-thick-7-2553202.pdf?src-supplier=Digikey; ComponentLink5URL: https://datasheet.ciiva.com/15189/getdatasheetpartid-251817-15189388.pdf?src-supplier=Verical; ComponentLink5Description: https://datasheet.ciiva.com/15189/getdatasheetpartid-251817-15189388.pdf?src-supplier=Verical; Supplier Part Number 1: 311-22.1KLRCT-ND; ComponentLink6URL: https://datasheet.ciiva.com/7983/1018594-7983501.pdf?src-supplier=Element14; ComponentLink6Description: https://datasheet.ciiva.com/7983/1018594-7983501.pdf?src-supplier=Element14
R11 = RMCF0402FT49R9: 49.9 Ω, 0402 Chip resistor; Manufacturer: Stackpole Electronics; house_part_number: R-49.9-0402-1%-001; Tolerance: 1%; Power Rating: 63mW; Temperature Coefficient: 100ppm/°C; Supplier 1: Digi-Key; Supplier Part Number 1: RMCF0402FT49R9CT-ND; RoHS: Yes; Category: Chip SMD Resistors; Stock 1: 723706; Pricing 1: 1=0.10000, 10=0.01300, 100=0.00530, 1000=0.00238, 2500=0.00207, 5000=0.00171 (USD); Mount: Surface Mount; Case Code (Metric): 1005; Contact Plating: Tin,Matte; Size Code: 0402; Min Operating Temperature: -55°C; Max Operating Temperature: 155°C; Packaging: Tape and Reel; Resistor Type: Thick Film; Number of Terminations: 2; Max Power Dissipation: 63mW; Features: Automotive AEC-Q200; Series: RMCF; Construction: Rectangular; Length: 1mm; Width: 0.02inch; Height: 0.016inch; Depth: 0.5mm; Radiation Hardening: No; Military Standard: Not; Lead Free: Lead Free; RoHS Compliant: Yes; ComponentLink1URL: http://components.arrow.com/part/dataview/44987983S6966749N1174?src-supplier=Arrow+Electronics; ComponentLink1Description: http://components.arrow.com/part/dataview/44987983S6966749N1174?src-supplier=Arrow+Electronics; ComponentLink2URL: https://www.verical.com/server-webapp/html/getDatasheet?partID=362596&src-supplier=Verical; ComponentLink2Description: https://www.verical.com/server-webapp/html/getDatasheet?partID=362596&src-supplier=Verical; ComponentLink3URL: http://www.seielect.com/Catalog/SEI-RMCF_RMCP.pdf?src-supplier=Future+Electronics; ComponentLink3Description: http://www.seielect.com/Catalog/SEI-RMCF_RMCP.pdf?src-supplier=Future+Electronics; ComponentLink4URL: https://www.seielect.com/catalog/SEI-RMCF_RMCP.pdf?src-supplier=Avnet; ComponentLink4Description: https://www.seielect.com/catalog/SEI-RMCF_RMCP.pdf?src-supplier=Avnet; ComponentLink5URL: https://www.seielect.com/Catalog/SEI-RMCF_RMCP.pdf?src-supplier=Digi-Key; ComponentLink5Description: https://www.seielect.com/Catalog/SEI-RMCF_RMCP.pdf?src-supplier=Digi-Key; Manufacturer Part Number: RMCF0402FT49R9; Case/Package: 0402
R28 = AC0402FR-07187KL: 187 kΩ, 1%, 0402 Chip resistor; Manufacturer: Yageo; Additional Feature: LASER TRIMMABLE; Power: 62.5mW; Rated Temperature: 70°C; Working Voltage: 50V; Temperature Coefficient (ppm/Cel): 100; Package Height: 0.32mm; Package Length: 1mm; Package Width: 0.5mm; Reference Standard: AEC-Q200; Supplier 1: Digikey; Manufacturer Part Number: AC0402FR-07187KL; RoHS: Yes; Category: Chip SMD Resistors; Stock 1: 17067; Pricing 1: 1=0.1, 10=0.005, 50=0.0046, 100=0.0041, 500=0.00306, 10000=0.00204, 20000=0.00194, 30000=0.00183 (USD); Mounting Technology: Surface Mount; Pins: 2; Package Shape: Rectangular; Terminal Finish: Nickel; Min Operating Temperature: -55°C; Max Operating Temperature: 155°C; Tolerance: 1%; JESD-609 Code: e3; Resistor Type: FIXED RESISTOR; Construction: Chip; Packaging: Tape and Reel; Technology: METAL GLAZE/THICK FILM; Termination: Wraparound; Reach SVHC Compliant: Yes; RoHS Compliant: Yes; ComponentLink1URL: https://datasheet.ciiva.com:443/pdfs/VipMasterIC/IC/YAGO/YAGO-S-A0003597364/YAGO-S-A0003597364-1.pdf?src-supplier=IHS+Markit; ComponentLink1Description: https://datasheet.ciiva.com:443/pdfs/VipMasterIC/IC/YAGO/YAGO-S-A0003597364/YAGO-S-A0003597364-1.pdf?src-supplier=IHS+Markit; ComponentLink2URL: http://www.yageo.com/NewPortal/yageodocoutput?fileName=/pdf/R-Chip/PYu-AC_51_RoHS_L_6.pdf&src-supplier=Digikey; ComponentLink2Description: http://www.yageo.com/NewPortal/yageodocoutput?fileName=/pdf/R-Chip/PYu-AC_51_RoHS_L_6.pdf&src-supplier=Digikey; ComponentLink3URL: https://datasheet.octopart.com/AC0402FR-07187KL-Yageo-datasheet-166720450.pdf?src-supplier=Future+Electronics; ComponentLink3Description: https://datasheet.octopart.com/AC0402FR-07187KL-Yageo-datasheet-166720450.pdf?src-supplier=Future+Electronics; Supplier Part Number 1: 13-AC0402FR-07187KLCT-ND
R29 = RC0402FR-071K65L: 1.65 kΩ, 1%, 0402 Chip capacitor; Manufacturer: Yageo; Additional Feature: LASER TRIMMABLE; Power: 62.5mW; Rated Temperature: 70°C; Working Voltage: 50V; Temperature Coefficient (ppm/Cel): 100; Package Height: 0.35mm; Package Length: 1mm; Package Width: 0.5mm; Supplier 1: Digikey; Manufacturer Part Number: RC0402FR-071K65L; RoHS: Yes; Category: Chip SMD Resistors; Stock 1: 267119; Pricing 1: 1=0.1, 10=0.004, 50=0.0036, 100=0.0031, 500=0.00294, 10000=0.00204, 20000=0.00179, 30000=0.0016, 50000=0.00149, 70000=0.00139 (USD); Mounting Technology: Surface Mount; Pins: 2; Package Shape: Rectangular; Terminal Finish: Nickel; Min Operating Temperature: -55°C; Max Operating Temperature: 155°C; Tolerance: 1%; JESD-609 Code: e3; Resistor Type: FIXED RESISTOR; Construction: Chip; Packaging: Tape and Reel; Technology: METAL GLAZE/THICK FILM; Termination: Wraparound; Reach SVHC Compliant: Yes; RoHS Compliant: Yes; ComponentLink1URL: https://datasheet.ciiva.com:443/pdfs/VipMasterIC/IC/YAGO/YAGO-S-A0008145938/YAGO-S-A0008145938-1.pdf?src-supplier=IHS+Markit; ComponentLink1Description: https://datasheet.ciiva.com:443/pdfs/VipMasterIC/IC/YAGO/YAGO-S-A0008145938/YAGO-S-A0008145938-1.pdf?src-supplier=IHS+Markit; ComponentLink2URL: https://datasheet.ciiva.com/26829/getdatasheetpartid-323718-26829959.pdf?src-supplier=Verical; ComponentLink2Description: https://datasheet.ciiva.com/26829/getdatasheetpartid-323718-26829959.pdf?src-supplier=Verical; ComponentLink3URL: https://datasheet.ciiva.com/8895/pyu-rc0402-51-rohs-l-6-8895143.pdf?src-supplier=Avnet; ComponentLink3Description: https://datasheet.ciiva.com/8895/pyu-rc0402-51-rohs-l-6-8895143.pdf?src-supplier=Avnet; ComponentLink4URL: https://datasheet.ciiva.com/17068/pyu-rc0402-51-rohs-l-6-r-17068206.pdf?src-supplier=Future+Electronics; ComponentLink4Description: https://datasheet.ciiva.com/17068/pyu-rc0402-51-rohs-l-6-r-17068206.pdf?src-supplier=Future+Electronics; Supplier Part Number 1: YAG3043CT-ND
R30 = RC0402FR-0760K4L: 60.4 kΩ, 1%, 0402 Chip resistor; Manufacturer: Yageo; Additional Feature: LASER TRIMMABLE; Power: 62.5mW; Rated Temperature: 70°C; Working Voltage: 50V; Temperature Coefficient (ppm/Cel): 100; Package Height: 0.35mm; Package Length: 1mm; Package Width: 0.5mm; Supplier 1: Digikey; Manufacturer Part Number: RC0402FR-0760K4L; RoHS: Yes; Category: Chip SMD Resistors; Stock 1: 167907; Pricing 1: 1=0.1, 10=0.015, 50=0.009, 100=0.0074, 500=0.00488, 1000=0.00413, 5000=0.00293, 10000=0.00257, 20000=0.00228, 30000=0.00214, 50000=0.00198, 70000=0.00188, 100000=0.00179, 250000=0.0016, 500000=0.00149, 1000000=0.00139 (USD); Mounting Technology: Surface Mount; Pins: 2; Package Shape: Rectangular; Terminal Finish: Nickel; Min Operating Temperature: -55°C; Max Operating Temperature: 155°C; Tolerance: 1%; Termination: Wraparound; JESD-609 Code: e3; Resistor Type: FIXED RESISTOR; Construction: Chip; Packaging: Tape and Reel; Technology: METAL GLAZE/THICK FILM; Reach SVHC Compliant: Yes; RoHS Compliant: Yes; ComponentLink1URL: https://datasheet.ciiva.com:443/pdfs/VipMasterIC/IC/YAGO/YAGO-S-A0008145938/YAGO-S-A0008145938-1.pdf?src-supplier=IHS+Markit; ComponentLink1Description: https://datasheet.ciiva.com:443/pdfs/VipMasterIC/IC/YAGO/YAGO-S-A0008145938/YAGO-S-A0008145938-1.pdf?src-supplier=IHS+Markit; ComponentLink2URL: https://datasheet.ciiva.com/8888/pyu-rc0402-51-rohs-l-6-8888622.pdf?src-supplier=Avnet; ComponentLink2Description: https://datasheet.ciiva.com/8888/pyu-rc0402-51-rohs-l-6-8888622.pdf?src-supplier=Avnet; ComponentLink3URL: https://datasheet.ciiva.com/17068/pyu-rc0402-51-rohs-l-6-r-17068614.pdf?src-supplier=Future+Electronics; ComponentLink3Description: https://datasheet.ciiva.com/17068/pyu-rc0402-51-rohs-l-6-r-17068614.pdf?src-supplier=Future+Electronics; Supplier Part Number 1: 311-60.4KLRCT-ND